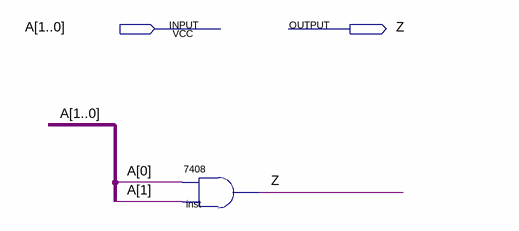
[diagram p0: schematic sheet]
// Quartus schematic and_2in.bdf as structural Verilog: 1 symbols, 2 pins
module and_2in (
  input  [1:0] A,
  output Z
);

  \7408  inst (.\3 (A[1]), .\2 (A[0]), .\1 (Z));
endmodule
